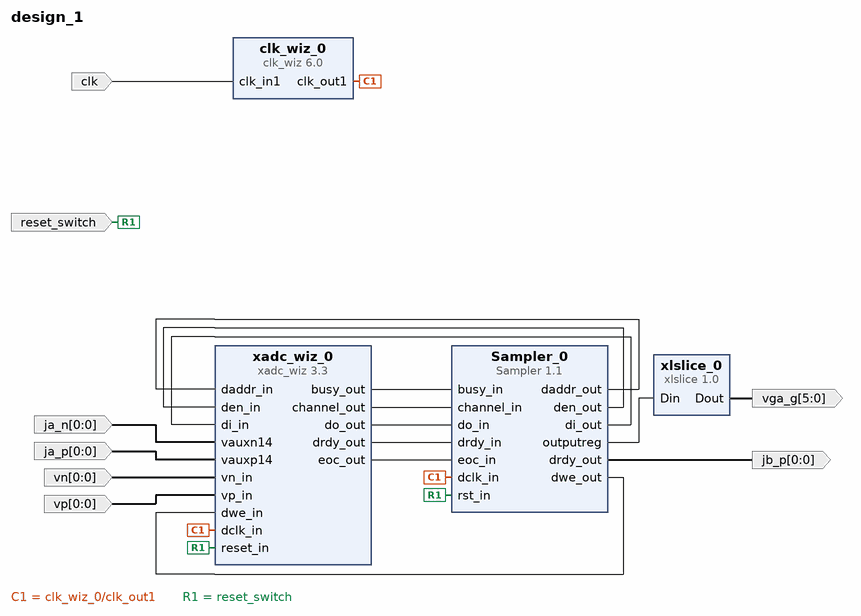
[diagram p0: block diagram of the top level]
# Vivado block design design_1, xc7z010clg400-1, Vivado 2021.2
create_bd_design design_1

create_bd_port -dir I -type clk clk
set_property -dict {CONFIG.FREQ_HZ 125000000} [get_bd_ports clk]
create_bd_port -dir O -from 5 -to 0 vga_g
create_bd_port -dir I reset_switch
create_bd_port -dir I -from 0 -to 0 ja_p
create_bd_port -dir I -from 0 -to 0 ja_n
create_bd_port -dir O -from 0 -to 0 jb_p
create_bd_port -dir I -from 0 -to 0 vp
create_bd_port -dir I -from 0 -to 0 vn

create_bd_cell -type ip -vlnv xilinx.com:ip:xadc_wiz:3.3 xadc_wiz_0
set_property -dict [list \
  CONFIG.ACQUISITION_TIME 4 \
  CONFIG.ADC_CONVERSION_RATE 1000 \
  CONFIG.ADC_OFFSET_AND_GAIN_CALIBRATION true \
  CONFIG.BIPOLAR_OPERATION true \
  CONFIG.CHANNEL_AVERAGING None \
  CONFIG.DCLK_FREQUENCY 130 \
  CONFIG.ENABLE_CALIBRATION_AVERAGING true \
  CONFIG.ENABLE_RESET true \
  CONFIG.ENABLE_VCCDDRO_ALARM false \
  CONFIG.ENABLE_VCCPAUX_ALARM false \
  CONFIG.ENABLE_VCCPINT_ALARM false \
  CONFIG.EXTERNAL_MUX_CHANNEL VP_VN \
  CONFIG.INTERFACE_SELECTION ENABLE_DRP \
  CONFIG.OT_ALARM false \
  CONFIG.SENSOR_OFFSET_AND_GAIN_CALIBRATION true \
  CONFIG.SENSOR_OFFSET_CALIBRATION true \
  CONFIG.SINGLE_CHANNEL_ACQUISITION_TIME false \
  CONFIG.SINGLE_CHANNEL_SELECTION VAUXP14_VAUXN14 \
  CONFIG.USER_TEMP_ALARM false \
  CONFIG.VCCAUX_ALARM false \
  CONFIG.VCCINT_ALARM false \
] [get_bd_cells xadc_wiz_0]
create_bd_cell -type ip -vlnv xilinx.com:ip:clk_wiz:6.0 clk_wiz_0
set_property -dict [list \
  CONFIG.CLKOUT1_JITTER 211.128 \
  CONFIG.CLKOUT1_PHASE_ERROR 240.486 \
  CONFIG.CLKOUT1_REQUESTED_OUT_FREQ 130 \
  CONFIG.MMCM_CLKFBOUT_MULT_F 39.000 \
  CONFIG.MMCM_CLKOUT0_DIVIDE_F 7.500 \
  CONFIG.MMCM_DIVCLK_DIVIDE 5 \
  CONFIG.USE_LOCKED false \
  CONFIG.USE_RESET false \
] [get_bd_cells clk_wiz_0]
create_bd_cell -type ip -vlnv xilinx.com:ip:xlslice:1.0 xlslice_0
set_property -dict {CONFIG.DIN_FROM 5 CONFIG.DIN_WIDTH 12 CONFIG.DOUT_WIDTH 6} [get_bd_cells xlslice_0]
create_bd_cell -type ip -vlnv xilinx.com:user:Sampler:1.1 Sampler_0
set_property -dict {CONFIG.C_AVG_COUNT 8 CONFIG.C_OUT_WIDTH 12} [get_bd_cells Sampler_0]

# ---- connections ----

connect_bd_net [get_bd_pins Sampler_0/daddr_out] [get_bd_pins xadc_wiz_0/daddr_in]
connect_bd_net [get_bd_pins Sampler_0/den_out] [get_bd_pins xadc_wiz_0/den_in]
connect_bd_net [get_bd_pins Sampler_0/di_out] [get_bd_pins xadc_wiz_0/di_in]
connect_bd_net [get_bd_pins Sampler_0/drdy_out] [get_bd_ports jb_p]
connect_bd_net [get_bd_pins Sampler_0/dwe_out] [get_bd_pins xadc_wiz_0/dwe_in]
connect_bd_net [get_bd_pins Sampler_0/outputreg] [get_bd_pins xlslice_0/Din]
connect_bd_net [get_bd_ports clk] [get_bd_pins clk_wiz_0/clk_in1]
connect_bd_net [get_bd_pins clk_wiz_0/clk_out1] [get_bd_pins xadc_wiz_0/dclk_in] [get_bd_pins Sampler_0/dclk_in]
connect_bd_net -net clk_wiz_0_locked [get_bd_ports reset_switch] [get_bd_pins xadc_wiz_0/reset_in] [get_bd_pins Sampler_0/rst_in]
connect_bd_net [get_bd_ports ja_n] [get_bd_pins xadc_wiz_0/vauxn14]
connect_bd_net [get_bd_ports ja_p] [get_bd_pins xadc_wiz_0/vauxp14]
connect_bd_net [get_bd_ports vn] [get_bd_pins xadc_wiz_0/vn_in]
connect_bd_net [get_bd_ports vp] [get_bd_pins xadc_wiz_0/vp_in]
connect_bd_net [get_bd_pins xadc_wiz_0/busy_out] [get_bd_pins Sampler_0/busy_in]
connect_bd_net [get_bd_pins xadc_wiz_0/channel_out] [get_bd_pins Sampler_0/channel_in]
connect_bd_net [get_bd_pins xadc_wiz_0/do_out] [get_bd_pins Sampler_0/do_in]
connect_bd_net [get_bd_pins xadc_wiz_0/drdy_out] [get_bd_pins Sampler_0/drdy_in]
connect_bd_net [get_bd_pins xadc_wiz_0/eoc_out] [get_bd_pins Sampler_0/eoc_in]
connect_bd_net [get_bd_pins xlslice_0/Dout] [get_bd_ports vga_g]

validate_bd_design
save_bd_design
